# EAGLE design Quadcopter (EAGLE 9.6.2)
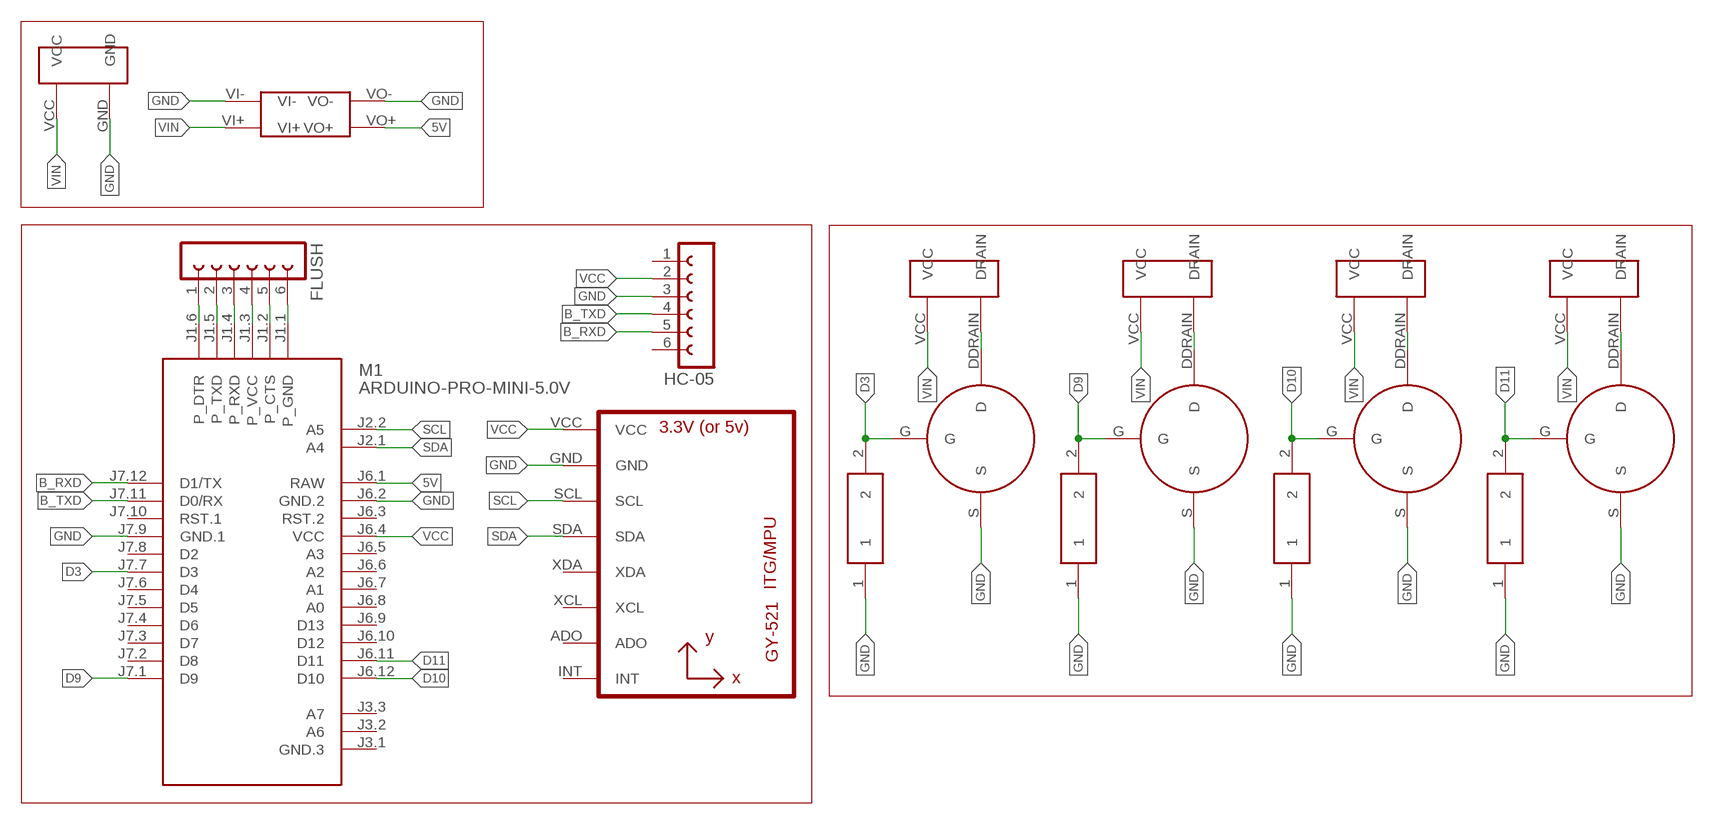
[diagram p0: schematic, sheet 1]

## Parts
FLUSH  FE06-1  [FE06]
HC-05  FE06-1  [FE06]
M1  ARDUINO-PRO-MINI-5.0V  [ARDUINO-PRO-MINI]
U1  GY-521MPU6050  [GY-521]
U$1  SI2306  [SI2306]
U$2  1206_RESISTOR  [1206_RESISTOR]
U$3  5V_TRANSFORMER  [5V_TRANSFORMER]
U$4  POWER_MAIN  [POWER_MAIN]
U$5  POWER_MOTOR  [POWER_MOTOR]
U$6  SI2306  [SI2306]
U$7  1206_RESISTOR  [1206_RESISTOR]
U$8  POWER_MOTOR  [POWER_MOTOR]
U$9  SI2306  [SI2306]
U$10  1206_RESISTOR  [1206_RESISTOR]
U$11  POWER_MOTOR  [POWER_MOTOR]
U$12  SI2306  [SI2306]
U$13  1206_RESISTOR  [1206_RESISTOR]
U$14  POWER_MOTOR  [POWER_MOTOR]

## Nets
5V: M1.J6.1(RAW) U$3.VO+
B_RXD: HC-05.5 M1.J7.12(D1/TX)
B_TXD: HC-05.4 M1.J7.11(D0/RX)
D3: M1.J7.7(D3) U$1.G U$2.2
D9: M1.J7.1(D9) U$6.G U$7.2
D10: M1.J6.12(D10) U$9.G U$10.2
D11: M1.J6.11(D11) U$12.G U$13.2
GND: HC-05.3 M1.J6.2(GND.2) M1.J7.9(GND.1) U1.GND U$1.S U$2.1 U$3.VI- U$3.VO- U$4.GND U$6.S U$7.1 U$9.S U$10.1 U$12.S U$13.1
N$1: FLUSH.1 M1.J1.6(P_DTR)
N$2: U$6.D U$8.DRAIN
N$3: FLUSH.2 M1.J1.5(P_TXD)
N$4: U$9.D U$11.DRAIN
N$5: U$1.D U$5.DRAIN
N$6: FLUSH.3 M1.J1.4(P_RXD)
N$7: U$12.D U$14.DRAIN
N$8: FLUSH.4 M1.J1.3(P_VCC)
N$9: FLUSH.5 M1.J1.2(P_CTS)
N$10: FLUSH.6 M1.J1.1(P_GND)
SCL: M1.J2.2(A5) U1.SCL
SDA: M1.J2.1(A4) U1.SDA
VCC: HC-05.2 M1.J6.4(VCC) U1.VCC
VIN: U$3.VI+ U$4.VCC U$5.VCC U$8.VCC U$11.VCC U$14.VCC
Unconnected: HC-05.1 HC-05.6 M1.J3.1(GND.3) M1.J3.2(A6) M1.J3.3(A7) M1.J6.3(RST.2) M1.J6.5(A3) M1.J6.6(A2) M1.J6.7(A1) M1.J6.8(A0) M1.J6.9(D13) M1.J6.10(D12) M1.J7.2(D8) M1.J7.3(D7) M1.J7.4(D6) M1.J7.5(D5) M1.J7.6(D4) M1.J7.8(D2) M1.J7.10(RST.1) U1.ADO U1.INT U1.XCL U1.XDA

## Library data of the parts
FLUSH HC-05 = con-lsta:FE06-1: FEMALE HEADER; OC_FARNELL: unknown; OC_NEWARK: unknown
M1 = diy-modules:ARDUINO-PRO-MINI-*: Arduino Pro Mini and compatible devices More details available here: https://www.arduino.cc/en/Main/ArduinoBoardProMini Click here to find device on ebay.com <http://www.ebay.com/sch/arduino+pro+mini>
U1 = gy-521:GY-521
U$1 U$6 U$9 U$12 = SI2306:SI2306
U$2 U$7 U$10 U$13 = 1206_resistor:1206_RESISTOR
U$3 = 5V_transformer:5V_TRANSFORMER
U$4 = power_main:POWER_MAIN
U$5 U$8 U$11 U$14 = power_motor:POWER_MOTOR

## Board
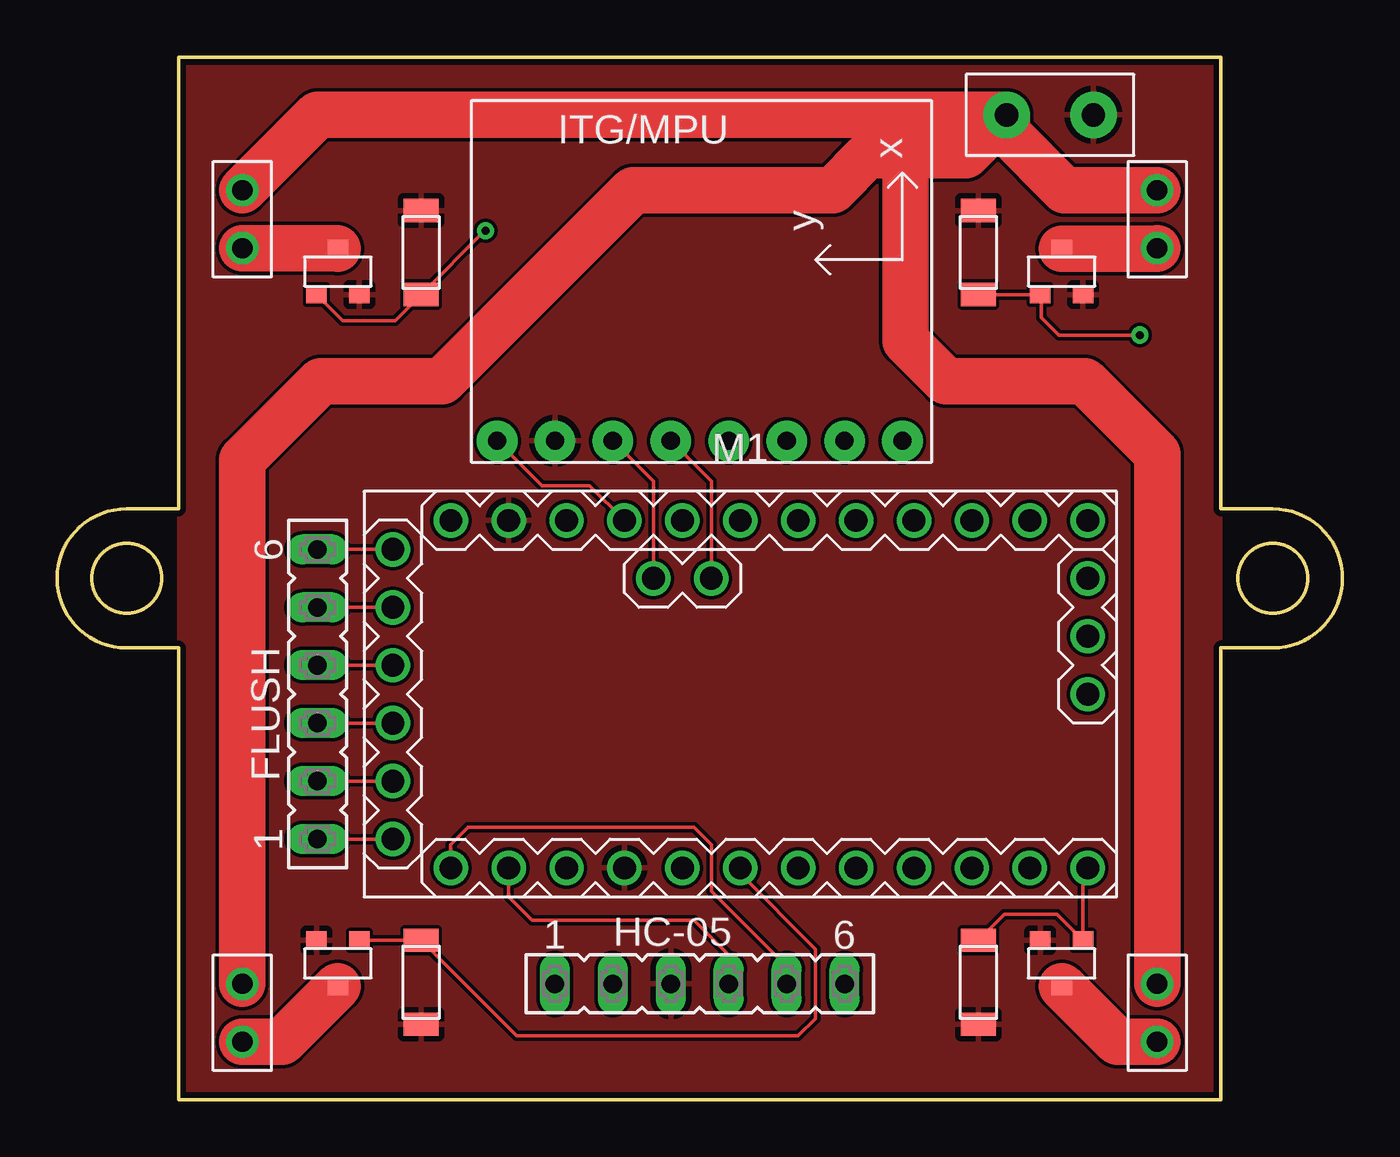
[diagram p1: board, top side]
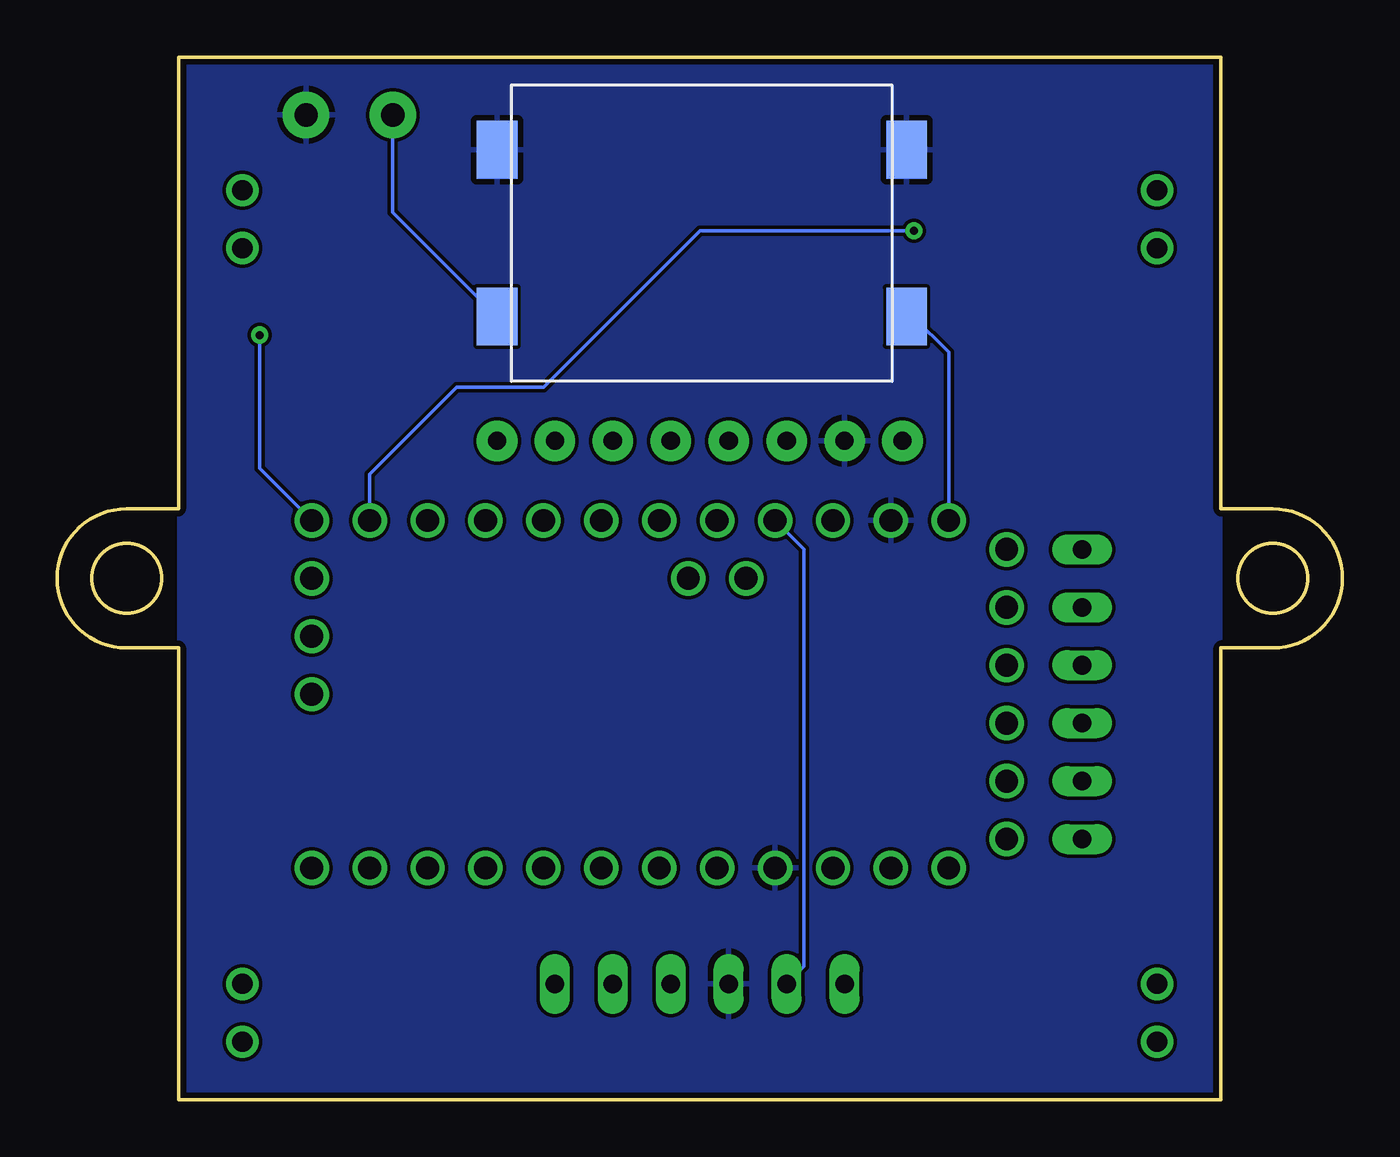
[diagram p2: board, bottom side, seen from below]

Size 56.39 x 45.72 mm. Coordinates in mm from the lower left corner, seen from the top.
Outline: 5.33,0 5.33,19.81 3.05,19.81 arc-90 0,22.86 arc-90 3.05,25.91 5.33,25.91 5.33,45.72 51.05,45.72 51.05,25.91 53.34,25.91 arc-90 56.39,22.86 arc-90 53.34,19.81 51.05,19.81 51.05,0 5.33,0
Outline: circle at 3.05,22.86 radius 1.52
Outline: circle at 53.34,22.86 radius 1.52
Copper layers (1*16): Top 0.035mm / dielectric 1.5mm / Bottom 0.035mm
Design rules "default *": minimum track width 6mil, minimum drill 0.35mm, track to track 6mil, track to pad 6mil, pad to pad 6mil, via to via 6mil, smd to smd 6mil, copper to edge 10mil, drill to drill 6mil, minimum pad ring 10mil, minimum via ring 8mil, stop-mask expansion 4mil, vias tented up to drill 0mil, thermal gap 10mil

### Footprints (pad centres in the part's own frame; a part is rotated, then mirrored left to right if it is on the bottom)
FE06 = drill 0.813 long: 1 -6.35,0; 2 -3.81,0; 3 -1.27,0; 4 1.27,0; 5 3.81,0; 6 6.35,0
ARDUINO-PRO-MINI = drill 1: J1.1 -15.24,6.35; J1.2 -15.24,3.81; J1.3 -15.24,1.27; J1.4 -15.24,-1.27; J1.5 -15.24,-3.81; J1.6 -15.24,-6.35; J2.1 -1.27,5.08; J2.2 -3.81,5.08; J3.1 15.24,0; J3.2 15.24,2.54; J3.3 15.24,5.08; J6.1 -12.7,7.62; J6.2 -10.16,7.62; J6.3 -7.62,7.62; J6.4 -5.08,7.62; J6.5 -2.54,7.62; J6.6 0,7.62; J6.7 2.54,7.62; J6.8 5.08,7.62; J6.9 7.62,7.62; J6.10 10.16,7.62; J6.11 12.7,7.62; J6.12 15.24,7.62; J7.1 15.24,-7.62; J7.2 12.7,-7.62; J7.3 10.16,-7.62; J7.4 7.62,-7.62; J7.5 5.08,-7.62; J7.6 2.54,-7.62; J7.7 0,-7.62; J7.8 -2.54,-7.62; J7.9 -5.08,-7.62; J7.10 -7.62,-7.62; J7.11 -10.16,-7.62; J7.12 -12.7,-7.62
GY-521 = drill 0.8 pad 1.778: ADO -10.477,-6.35; GND -10.477,6.35; INT -10.477,-8.89; SCL -10.477,3.81; SDA -10.477,1.27; VCC -10.477,8.89; XCL -10.477,-3.81; XDA -10.477,-1.27
SI2306 = smd 0.889 x 0.787: D 0,2.007; G -0.94,0; S 0.94,0
1206_RESISTOR = smd 1.016 x 1.524: 1 -0.254,0.794; 2 3.429,0.794
5V_TRANSFORMER = smd 1.778 x 2.54: VI+ -0.635,2.845; VI- -0.635,10.16; VO+ 17.323,2.845; VO- 17.323,10.16
POWER_MAIN = drill 1.016 pad 2.032: GND 5.588,1.778; VCC 1.778,1.778
POWER_MOTOR = drill 0.889 pad 1.422: DRAIN 3.81,1.27; VCC 1.27,1.27

### Placement (x,y rotation side)
FLUSH  11.43,17.78 90 top
HC-05  28.19,5.08 0 top
M1  29.97,17.78 0 top
U1  28.19,39.37 90 top
U$1  12.32,6.99 180 top
U$2  16.76,3.56 90 top
U$3  36.45,31.5 0 bottom
U$4  39.88,41.4 0 top
U$5  6.86,6.35 270 top
U$6  44.07,6.99 180 top
U$7  41.21,3.56 90 top
U$8  46.99,6.35 270 top
U$9  44.07,35.31 0 top
U$10  39.62,38.73 270 top
U$11  46.99,41.15 270 top
U$12  12.32,35.31 0 top
U$13  15.18,38.73 270 top
U$14  6.86,41.15 270 top

### Tracks (layer width: path | path; a pad name or v marks a point on that pad's centre or on a via)
5V
  Bottom 0.152: U$3.VO+ 18.85,34.34 17.27,32.77 M1.J6.1
B_RXD
  Top 0.152: HC-05.5 32,5.84 28.7,9.14 28.7,11.18 27.94,11.94 18.03,11.94 17.27,11.18 M1.J7.12
B_TXD
  Top 0.152: M1.J7.11 19.81,8.89 20.83,7.87 27.94,7.87 29.46,6.35 HC-05.4
D3
  Top 0.152: U$1.G U$2.2 20.16,2.79 32.51,2.79 33.27,3.56 33.27,6.6 29.97,9.91 M1.J7.7
D9
  Top 0.152: U$7.2 41.56,8.13 43.87,8.13 U$6.G 45.01,9.96 M1.J7.1
D10  (via drill 0.35)
  Top 0.152: U$10.2 U$9.G 43.18,35.26 43.18,34.29 43.94,33.53 v47.5,33.53
  Bottom 0.152: v47.5,33.53 47.5,27.69 M1.J6.12
D11  (via drill 0.35)
  Top 0.152: U$12.G 12.52,34.16 14.83,34.16 U$13.2 18.76,38.1 v18.8,38.1
  Bottom 0.152: v18.8,38.1 28.19,38.1 35.05,31.24 38.86,31.24 42.67,27.43 M1.J6.11
GND
  pour Top: 5.33,0 51.05,0 51.05,45.72 5.33,45.72
  pour Bottom: 5.33,0 51.05,0 51.05,45.72 5.33,45.72
N$1
  Top 0.152: M1.J1.6 FLUSH.1
N$2
  Top 2.032: U$6.D 46.51,2.54 U$8.DRAIN
N$3
  Top 0.152: M1.J1.5 FLUSH.2
N$4
  Top 2.032: U$11.DRAIN 48.23,37.31 U$9.D
N$5
  Top 2.032: U$1.D 9.88,2.54 U$5.DRAIN
N$6
  Top 0.152: FLUSH.3 M1.J1.4
N$7
  Top 2.032: U$14.DRAIN 12.29,37.34 U$12.D
N$8
  Top 0.152: FLUSH.4 M1.J1.3
N$9
  Top 0.152: FLUSH.5 M1.J1.2
N$10
  Top 0.152: FLUSH.6 M1.J1.1
SCL
  Top 0.152: U1.SCL 26.16,27.11 M1.J2.2
SDA
  Top 0.152: U1.SDA 28.7,27.11 M1.J2.1
VCC
  Top 0.152: U1.VCC 21.27,26.92 23.37,26.92 M1.J6.4
  Bottom 0.152: M1.J6.4 23.62,24.13 23.62,5.84 HC-05.2
VIN
  Top 2.032: U$14.VCC 11.43,43.18 39.5,43.18 | 39.5,43.18 U$4.VCC | U$4.VCC 41.66,42.42 44.2,39.88 U$11.VCC | U$8.VCC 48.26,28.32 45.08,31.5 38.99,31.5 37.21,33.27 37.21,40.89 39.5,43.18 | U$5.VCC 8.13,28.07 11.56,31.5 16.89,31.5 25.27,39.88 34.04,39.88 35.56,41.4 39.88,41.4 U$4.VCC
  Bottom 0.152: U$3.VI+ 41.66,38.91 U$4.VCC